# EAGLE design PoERegulator8023af (EAGLE 6.5.0)
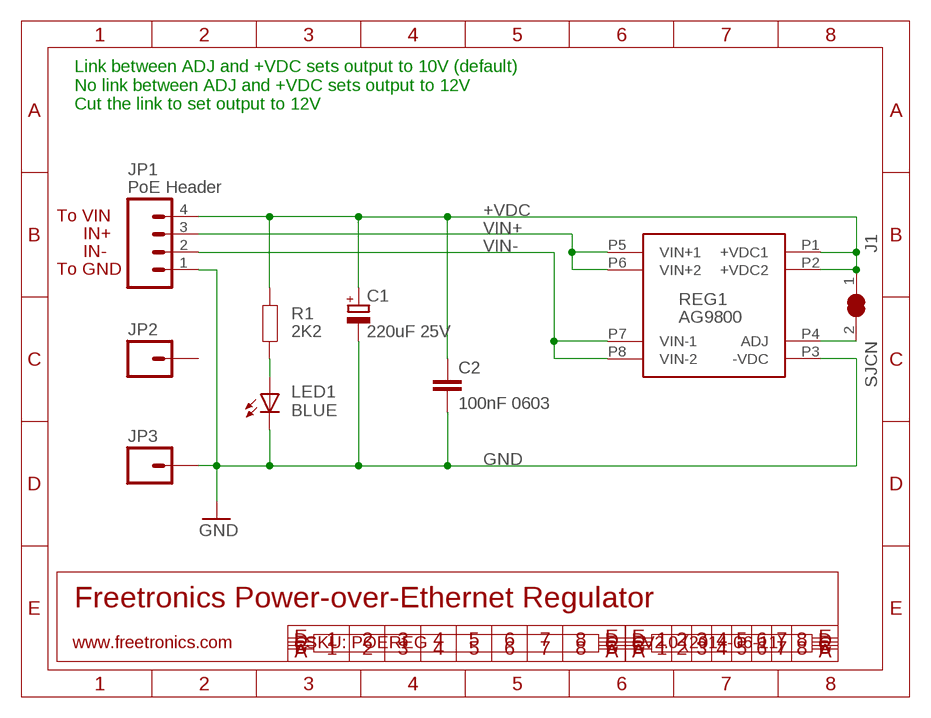
[diagram p0: schematic, sheet 1]

## Parts
C1  220uF 25V  CPOL-EUD  [PANASONIC_D]
C2  100nF 0603  CAP0603  [0603]
J1  SJCN  [SJC]
JP1  PoE Header  M04PTH  [1X04]
JP2  M01PTH  [1X01]
JP3  M01PTH  [1X01]
LED1  BLUE  LED0603  [LED-0603]
R1  2K2  RESISTOR0603  [0603]
REG1  AG9800  [AG9800]

## Nets
+VDC: C1.+ C2.1 J1.1 JP1.4 R1.1 REG1.P1(+VDC1) REG1.P2(+VDC2)
GND: C1.- C2.2 JP1.1 JP3.1 LED1.C REG1.P3(-VDC)
N$1: J1.2 REG1.P4(ADJ)
N$131: LED1.A R1.2
VIN+: JP1.3 REG1.P5(VIN+1) REG1.P6(VIN+2)
VIN-: JP1.2 REG1.P7(VIN-1) REG1.P8(VIN-2)
Unconnected: JP2.1

## Notes on the sheet
- Link between ADJ and +VDC sets output to 10V (default)
  No link between ADJ and +VDC sets output to 12V
  Cut the link to set output to 12V
- To VIN
- IN+
- IN-
- To GND
- Freetronics Power-over-Ethernet Regulator
- www.freetronics.com | SKU: POEREG | V2.0 (2014-06-11)

## Library data of the parts
C1 = rcl:CPOL-EU: POLARIZED CAPACITOR, European symbol
C2 = freetronics-master-v1.1:CAP: Capacitor Standard 0603 ceramic capacitor, and 0.1" leaded capacitor.
J1 = freetronics-jon:SJC
JP1 = freetronics:M04: Header 4 Standard 4-pin 0.1" header. Use with straight break away headers (SKU : PRT-00116), right angle break away headers (PRT-00553), swiss pins (PRT-00743), machine pins (PRT-00117), and female headers (PRT-00115). Molex polarized connector foot print use with SKU : PRT-08231 with associated crimp pins and housings.
JP2 JP3 = freetronics:M01: Header 1 Standard 1-pin 0.1" header. Use with straight break away headers (SKU : PRT-00116), right angle break away headers (PRT-00553), swiss pins (PRT-00743), machine pins (PRT-00117), and female headers (PRT-00115).
LED1 = freetronics:LED: LEDs Standard schematic elements and footprints for 5mm, 3mm, 1206, and 0603 sized LEDs. 5mm - Spark Fun Electronics SKU : COM-00529 (and others)
R1 = freetronics:RESISTOR: Resistor Basic schematic elements and footprints for 0603, 1206, and PTH 1/10th watt (small) resistors.
REG1 = freetronics-jon:AG9800

## Board
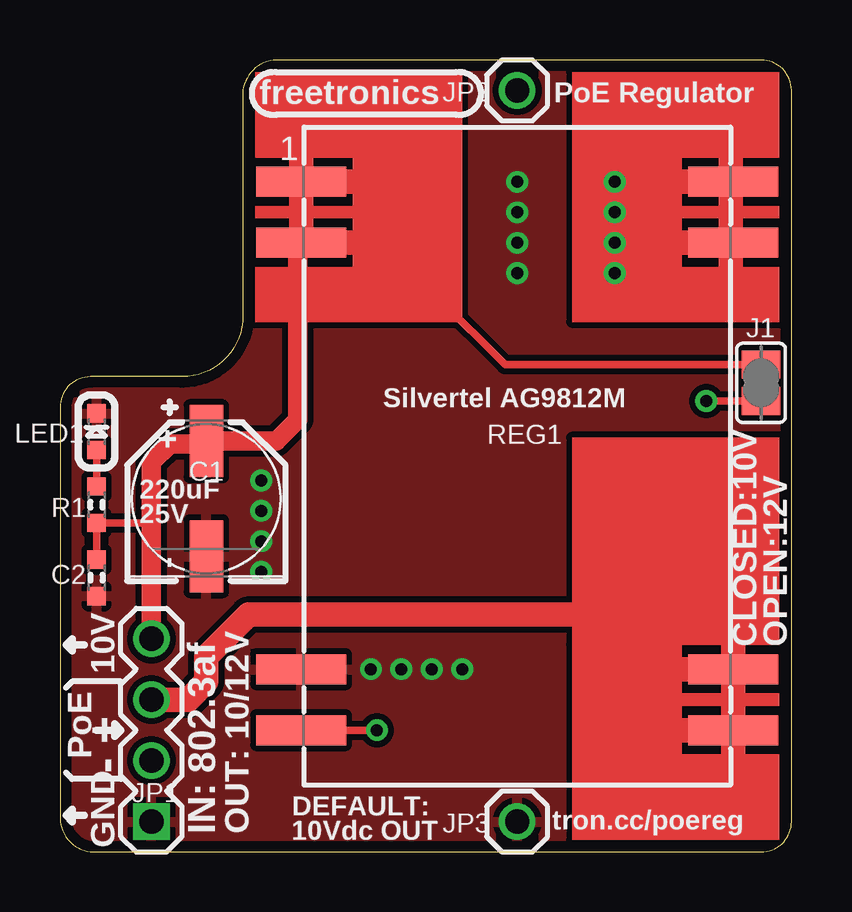
[diagram p1: board, top side]
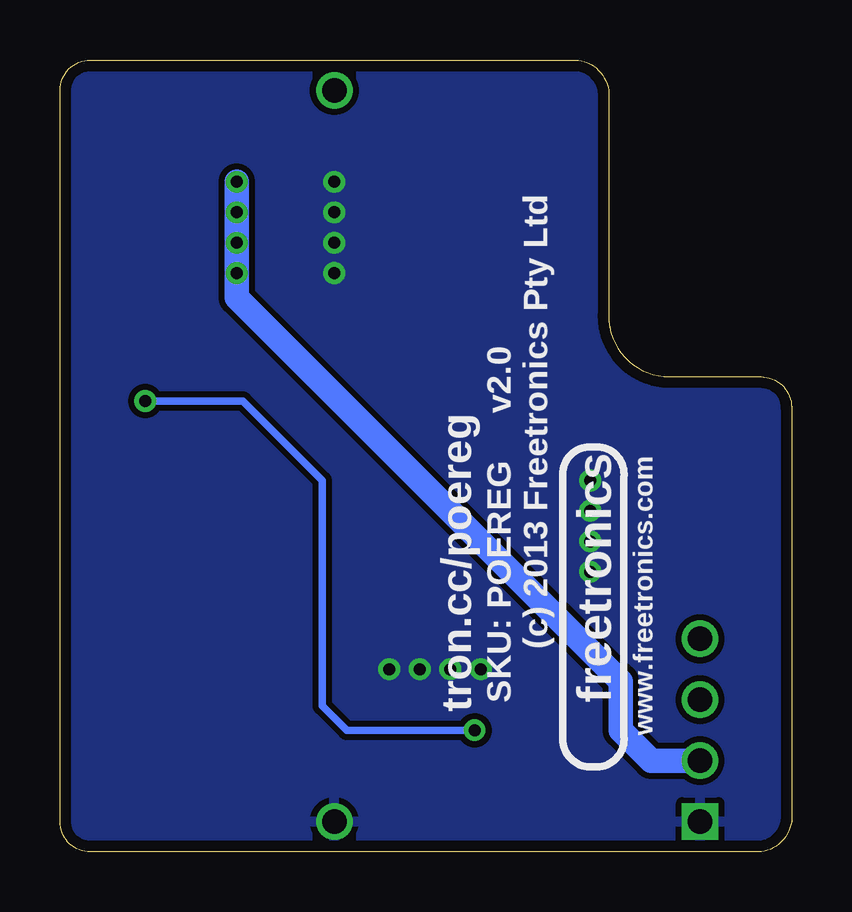
[diagram p2: board, bottom side, seen from below]

Size 30.48 x 33.02 mm. Coordinates in mm from the lower left corner, seen from the top.
Outline: 0,1.27 arc74 1.27,0 29.21,0 arc90 30.48,1.27 30.48,31.75 arc90 29.21,33.02 8.89,33.02 arc74 7.62,31.75 7.62,22.35 arc-90 5.08,19.81 1.27,19.81 arc90 0,18.54 0,1.27
Copper layers (1*16): Top 0.035mm / dielectric 1.5mm / Bottom 0.035mm
Design rules "default *": minimum track width 10mil, minimum drill 18mil, track to track 10mil, track to pad 10mil, pad to pad 10mil, via to via 10mil, smd to smd 8mil, copper to edge 18mil, drill to drill 8mil, minimum pad ring 10mil, minimum via ring 8mil, stop-mask expansion 4mil, vias tented up to drill 25mil, thermal gap 10mil

### Footprints (pad centres in the part's own frame; a part is rotated, then mirrored left to right if it is on the bottom)
PANASONIC_D = smd 3 x 1.4: + 2.4,0; - -2.4,0
0603 = smd 0.762 x 0.762: 1 -0.762,0; 2 0.762,0
SJC = smd 1.168 x 1.6: 1 -0.762,0; 2 0.762,0
1X04 = drill 1.016 square: 1 0,0 | drill 1.016: 2 2.54,0; 3 5.08,0; 4 7.62,0
1X01 = drill 1.016: 1 0,0
LED-0603 = smd 0.762 x 0.762: A -0.762,0; C 0.762,0
AG9800 = smd 3.75 x 1.25: P1 -9,11.43; P2 -9,8.89; P3 -9,-8.89; P4 -9,-11.43; P5 9,-11.43; P6 9,-8.89; P7 9,8.89; P8 9,11.43

### Placement (x,y rotation side)
C1  6.1,14.73 90 top
C2  1.52,11.43 270 top
J1  29.21,19.56 270 top
JP1  3.81,1.27 90 top
JP2  19.05,31.75 0 top
JP3  19.05,1.27 0 top
LED1  1.52,17.53 90 top
R1  1.52,14.48 90 top
REG1  19.05,16.51 0 top

### Tracks (layer width: path | path; a pad name or v marks a point on that pad's centre or on a via)
+VDC
  Top 0.305: J1.1 18.54,20.32 15.75,23.11 9.91,23.11 | 3.81,13.72 R1.1 C2.1
  Top 0.813: JP1.4 3.81,13.72 3.81,16.26 4.57,17.02 5.84,17.02 C1.+ 9,17.13 9.91,18.03 9.91,23.11 9.91,25.4 REG1.P2
  Top 1.016: REG1.P1 10.05,30.37 10.16,30.48 | REG1.P1 REG1.P2 | REG1.P1 13.72,27.94 | 9.91,25.4 13.72,25.4
GND  (via drill 0.5)
  other vias: 12.95,7.62 14.22,7.62 15.49,7.62 16.76,7.62 19.05,26.67 19.05,25.4 19.05,24.13 8.38,11.68 8.38,12.95 19.05,27.94 8.38,14.22 8.38,15.49
  pour Top: 1.27,0 arc-90 0,1.27 0,18.54 arc-90 1.27,19.81 5.08,19.81 arc90 7.62,22.35 7.62,31.75 arc-90 8.89,33.02 29.21,33.02 arc-90 30.48,31.75 30.48,1.27 arc-90 29.21,0
  pour Bottom: 0,1.27 0,18.54 arc-90 1.27,19.81 5.08,19.81 arc90 7.62,22.35 7.62,31.75 arc-90 8.89,33.02 29.21,33.02 arc-90 30.48,31.75 30.48,1.27 arc-90 29.21,0 1.27,0 arc-90
N$1  (via drill 0.5)
  Top 0.305: REG1.P4 v13.21,5.08 | v26.92,18.8 J1.2
  Bottom 0.305: v13.21,5.08 18.54,5.08 19.56,6.1 19.56,15.49 22.86,18.8 v26.92,18.8
N$131
  Top 0.305: LED1.A R1.2
VIN+
  Top 1.016: JP1.3 5.33,6.35 6.1,7.11 6.1,8.13 7.87,9.91 27.94,9.91 28.05,9.8 REG1.P6 | REG1.P5 28.05,2.9 27.94,2.79 | REG1.P6 REG1.P5 | REG1.P6 24.64,7.62 | REG1.P5 25.15,5.08
VIN-  (via drill 0.5)
  Top 1.016: REG1.P8 27.94,27.94 | 27.94,27.94 27.94,29.97 | 27.94,27.94 27.94,25.51 REG1.P7 27.94,25.4 | 27.94,25.4 27.94,23.62 | 27.94,27.94 v23.11,27.94 v23.11,24.13 v23.11,25.4 v23.11,26.67 | 27.94,25.4 24.89,25.4
  Bottom 1.016: JP1.2 5.84,3.81 7.11,5.08 7.11,7.11 23.11,23.11 v23.11,27.94
(copper drawn outside any net)
  shapes: Top area x12

### Text on the board
tPlace: freetronics | PoE Regulator | Silvertel AG9812M | + | 220uF | 25V | - | CLOSED:10V | OPEN:12V | 10V | PoE | - + | DEFAULT: | IN: 802.3af | OUT: 10/12V | 10Vdc OUT | tron.cc/poereg | GND
bPlace: (c) 2013 Freetronics Pty Ltd | SKU: POEREG v2.0 | tron.cc/poereg | www.freetronics.com | freetronics
tDocu: + | K | A | -